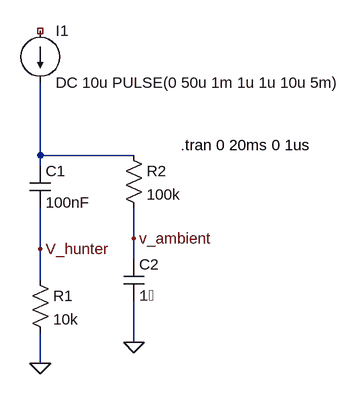
[diagram p0: schematic ambient_referenced_detector_draft1.asc]
ambient_referenced_detector_draft1.asc, the LTspice schematic file:
Version 4
SHEET 1 880 680
WIRE 224 288 224 176
WIRE 368 288 224 288
WIRE 224 304 224 288
WIRE 368 416 368 368
WIRE 224 432 224 368
WIRE 368 448 368 416
WIRE 224 480 224 432
WIRE 368 576 368 512
WIRE 224 608 224 560
FLAG 224 608 0
FLAG 368 576 0
FLAG 224 432 V_hunter
FLAG 368 416 v_ambient
SYMBOL current 224 96 R0
SYMATTR InstName I1
SYMATTR Value DC 10u PULSE(0 50u 1m 1u 1u 10u 5m)
SYMBOL cap 208 304 R0
SYMATTR InstName C1
SYMATTR Value 100nF
SYMBOL res 208 464 R0
SYMATTR InstName R1
SYMATTR Value 10k
SYMBOL res 352 272 R0
SYMATTR InstName R2
SYMATTR Value 100k
SYMBOL cap 352 448 R0
SYMATTR InstName C2
SYMATTR Value 1�
TEXT 440 272 Left 2 !.tran 0 20ms 0 1us

The netlist it stands for:
* ambient_referenced_detector_draft1.asc
I1 NC_01 N001 DC 10u PULSE(0 50u 1m 1u 1u 10u 5m)
C1 N001 V_hunter 100nF
R1 V_hunter 0 10k
R2 N001 v_ambient 100k
C2 v_ambient 0 1�
.tran 0 20ms 0 1us
.backanno
.end